# Altium schematic sheet Modulo BL652.SchDoc
size Letter
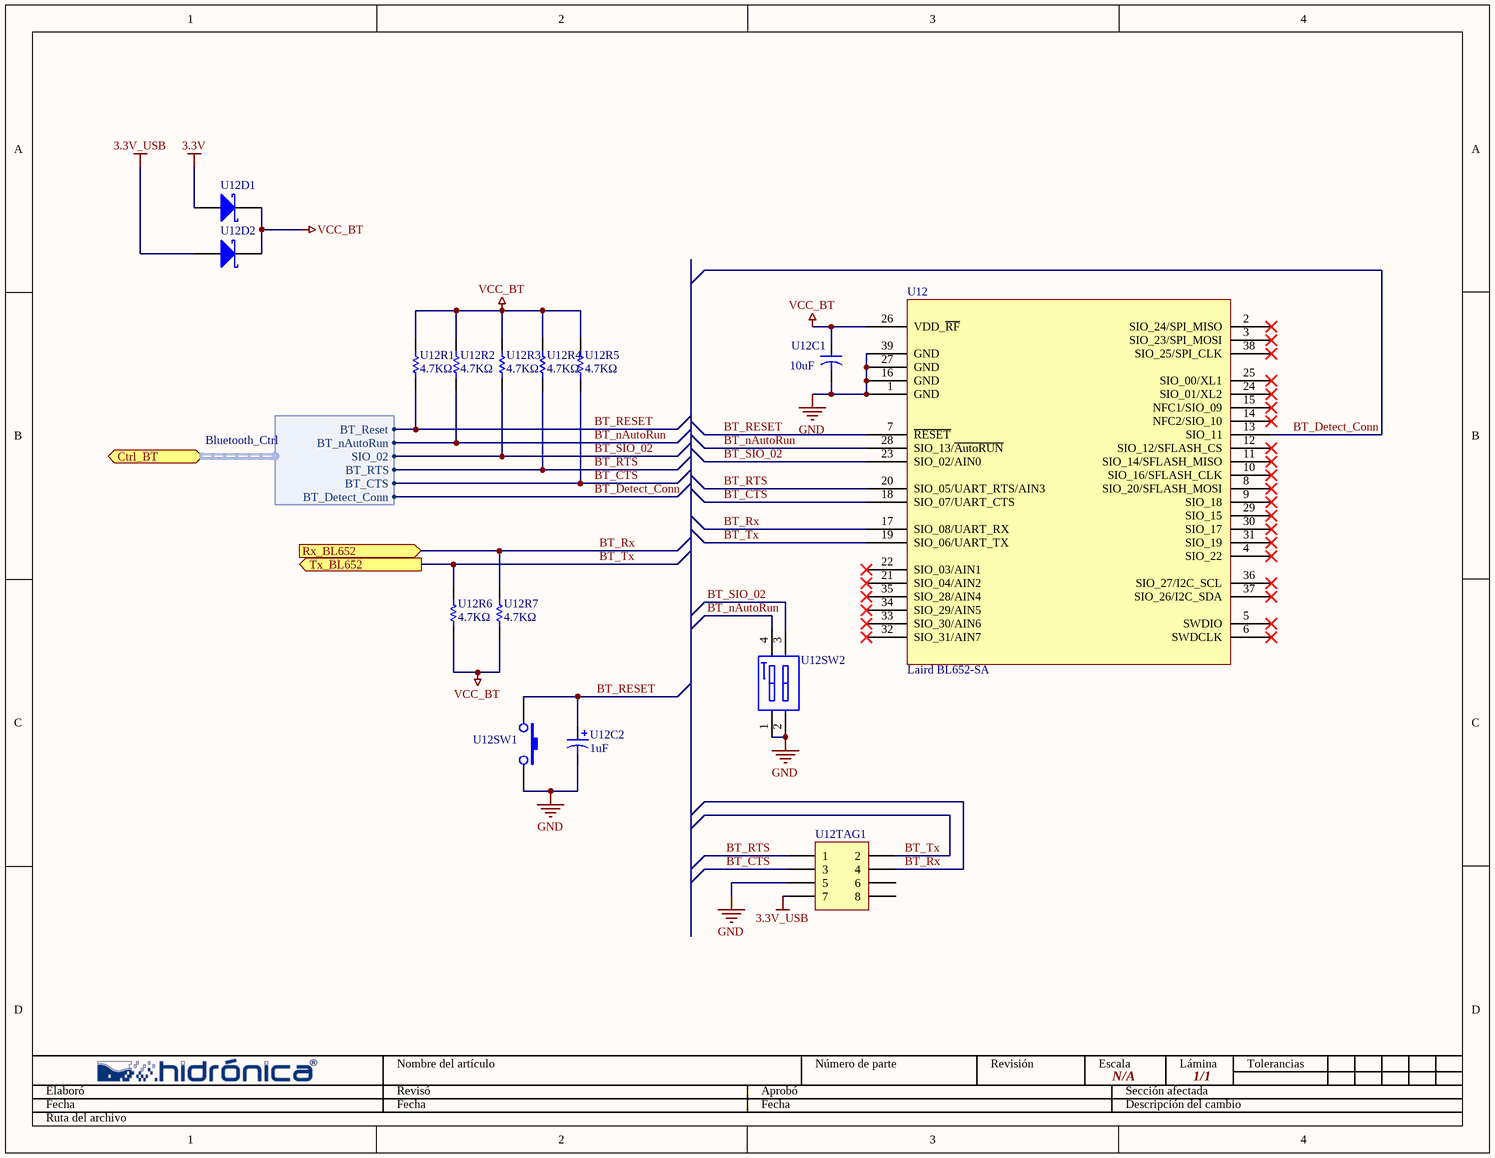
[diagram p0: Modulo BL652.SchDoc]

## Parts
U12  Laird BL652-SA  [BT652]
U12C1  10uF  [1206-CAP]
U12C2  1uF  [0805-tan]
U12D1  NSR0320MW2T1G  [SOD-323]  (value not drawn)
U12D2  NSR0320MW2T1G  [SOD-323]  (value not drawn)
U12R1  4.7KΩ  [0805-RES]
U12R2  4.7KΩ  [0805-RES]
U12R3  4.7KΩ  [0805-RES]
U12R4  4.7KΩ  [0805-RES]
U12R5  4.7KΩ  [0805-RES]
U12R6  4.7KΩ  [0805-RES]
U12R7  4.7KΩ  [0805-RES]
U12SW1  (no value)  [430 473 031 826]
U12SW2  SW DIP-2  [CHS-02TA]  (value not drawn)
U12TAG1  Header 4X2  [690367290876]  (value not drawn)

## Ports
Ctrl_BT (harness Bluetooth_Ctrl), Rx_BL652 (in), Tx_BL652 (out)

## Harnesses
Bluetooth_Ctrl: BT_Reset, BT_nAutoRun, SIO_02, BT_RTS, BT_CTS, BT_Detect_Conn

## Nets
3.3V: U12D1.1(A)
3.3V_USB: U12D2.1(A) U12TAG1.7
GND: U12.1(GND) U12.16(GND) U12.27(GND) U12.39(GND) U12C1.2 U12C2.2 U12SW1.2 U12SW2.1(A1) U12SW2.2(A2) U12TAG1.5
VCC_BT: U12.26(VDD_~{RF}) U12C1.1 U12D1.2(K) U12D2.2(K) U12R1.1 U12R2.1 U12R3.1 U12R4.1 U12R5.1 U12R6.2 U12R7.2
BT_CTS: U12.18(SIO_07/UART_CTS) U12R5.2 U12TAG1.3 ; port Ctrl_BT.BT_CTS
BT_Detect_Conn: U12.13(SIO_11) ; port Ctrl_BT.BT_Detect_Conn
BT_nAutoRun: U12.28(SIO_13/~{AutoRUN}) U12R2.2 U12SW2.4(B1) ; port Ctrl_BT.BT_nAutoRun
BT_RESET: U12.7(~{RESET}) U12C2.1 U12R1.2 U12SW1.1 ; port Ctrl_BT.BT_Reset
BT_RTS: U12.20(SIO_05/UART_RTS/AIN3) U12R4.2 U12TAG1.1 ; port Ctrl_BT.BT_RTS
BT_Rx: U12.17(SIO_08/UART_RX) U12R7.1 U12TAG1.4 ; port Rx_BL652
BT_SIO_02: U12.23(SIO_02/AIN0) U12R3.2 U12SW2.3(B2) ; port Ctrl_BT.SIO_02
BT_Tx: U12.19(SIO_06/UART_TX) U12R6.1 U12TAG1.2 ; port Tx_BL652

Not connected (* = marked no-connect by the designer): U12 2(SIO_24/SPI_MISO)* 3(SIO_23/SPI_MOSI)* 4(SIO_22)* 5(SWDIO)* 6(SWDCLK)* 8(SIO_20/SFLASH_MOSI)* 9(SIO_18)* 10(SIO_16/SFLASH_CLK)* 11(SIO_14/SFLASH_MISO)* 12(SIO_12/SFLASH_CS)* 14(NFC2/SIO_10)* 15(NFC1/SIO_09)* 21(SIO_04/AIN2)* 22(SIO_03/AIN1)* 24(SIO_01/XL2)* 25(SIO_00/XL1)* 29(SIO_15)* 30(SIO_17)* 31(SIO_19)* 32(SIO_31/AIN7)* 33(SIO_30/AIN6)* 34(SIO_29/AIN5)* 35(SIO_28/AIN4)* 36(SIO_27/I2C_SCL)* 37(SIO_26/I2C_SDA)* 38(SIO_25/SPI_CLK)*; U12TAG1 6 8

## Notes on the sheet
- Elaboró
- Fecha
- Nombre del artículo
- Revisó
- Aprobó
- Número de parte
- Revisión
- Escala
- N/A
- Sección afectada
- Descripción del cambio
- Lámina
- 1/1
- Tolerancias
- Ruta del archivo

## Library data of the parts
U12 = BL652_SA: Manufacturer Part Number: BL652-SA-01-T/R; Manufacturer: Laird; Supplier Part Number 1: BL652-SA-01-CT-ND; Supplier 1: Digi-Key; Supplier 2: Mouser; Supplier Part Number 2: 239-BL652-SA-01; Supplier 3: Newark; Supplier Part Number 3: 01AC1558
U12C1 = Cap2: CAP TANTALUM 10UF 6.3V 10% SMD; Manufacturer: Kemet; Manufacturer Part Number: T491A106K010AT; Value: 10uF; Supplier 1: Digi-Key; Supplier Part Number 1: 399-3684-1-ND
U12C2 = Cap Pol1: AVX - TACU105M016X - CAP TANT 1UF, 16V, 7.5OHM, 0805; Manufacturer: AVX Corporation; Manufacturer Part Number: TAJR105K010RNJ; Value: 1uF; Supplier 1: Digi-Key; Supplier Part Number 1: 478-3278-1-ND
U12D1 U12D2 = 10MQ060N: DIODE SCHOTTKY 1A 20V SOD-323; Manufacturer: ON Semiconductor; Manufacturer Part Number: NSR0320MW2T1G; Supplier 1: Digi-Key; Supplier Part Number 1: NSR0320MW2T1GOSCT-ND
U12R1-U12R7 = Res1: RES SMD 4.7K OHM 5% 1/8W 0805; Manufacturer: Panasonic Electronic Components; Manufacturer Part Number: ERJ-6GEYJ472V; Value: 4.7KΩ; Supplier 1: Digi-Key; Supplier Part Number 1: P4.7KACT-ND
U12SW1 = SW-PB: SWITCH TACTILE SPST-NO 0.02A 15V SMT; Manufacturer Part Number: EVQ-Q2K03W; Manufacturer: Panasonic Electronic Components; Supplier Part Number 1: P12943SCT-ND; Supplier 1: Digi-Key
U12SW2 = SW DIP-2: SWITCH SLIDE DIP SPST 100MA 6V; Manufacturer: Nidec Copal Electronics; Manufacturer Part Number: CHS-02TA; Supplier Part Number 1: 563-1005-1-ND; Supplier 1: Digi-Key
U12TAG1 = Header 4X2: Female SMT Straight Connector with Latch and with Polarization WR-MM 8-Pin; Contraparte: 690 157 000 872; Manufacturer Part Number: 690 367 290 876; Manuacturer: Wurth Elektronik; Supplier Part Number 1: 690 367 290 876; Supplier 1: Wurth Elektronik